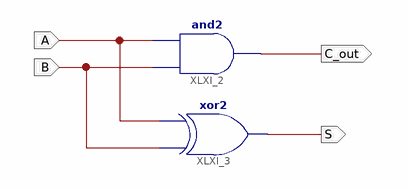
[diagram p0: schematic sheet 1]
// Xilinx ISE schematic ECE281_CPX2_Celiano_HA.sch (spartan3e) as structural Verilog: 2 symbols, 4 ports
module ECE281_CPX2_Celiano_HA (
  input  A,
  input  B,
  output S,
  output C_out
);

  and XLXI_2 (C_out, B, A);
  xor XLXI_3 (S, B, A);
endmodule
